# Altium schematic sheet [06]-POWER_SUPPLY.SchDoc
size A4; Organization: Indruino Co., Ltd; Address1: No. 1, Vo Van Ngan Street; Address2: Thu Duc District, HCMC; SheetNumber: 7; SheetTotal: 9
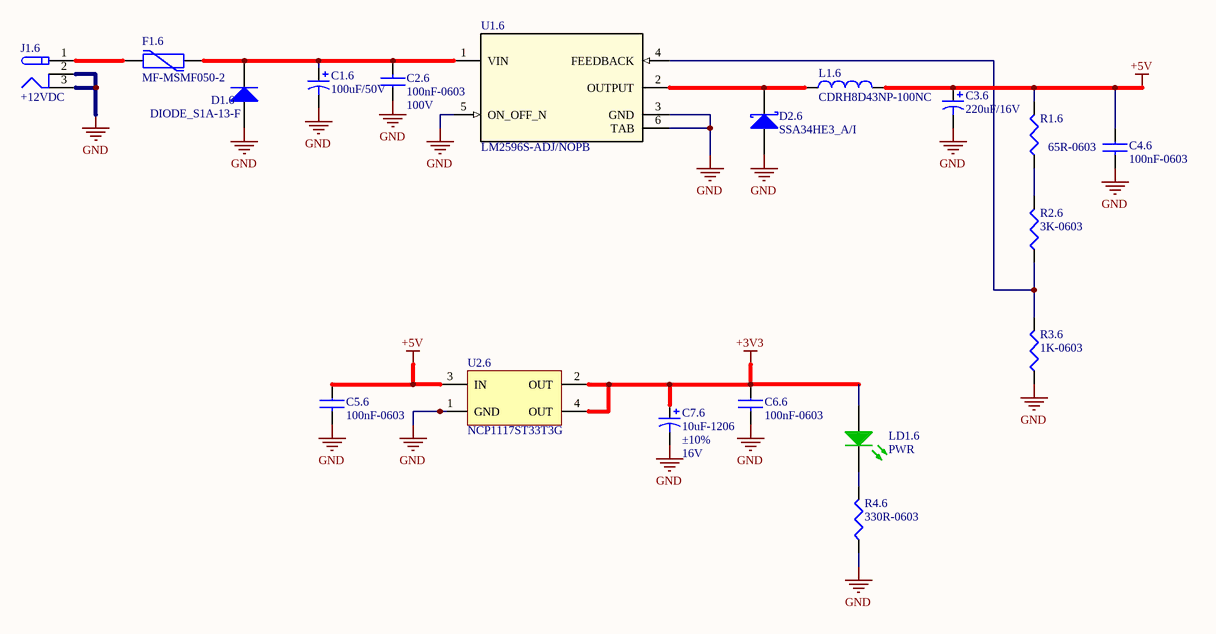
[diagram p0: [06]-POWER_SUPPLY.SchDoc]

## Parts
C1.6  value 100uF/50V  [CAPPR5-10x16]  (hidden comment: Cap Polar)
C2.6  100nF-0603  Voltage - Rated: 100V  [CAP0603]
C3.6  value 220uF/16V  [CAPPR5-10x16]  (hidden comment: Cap Polar)
C4.6  100nF-0603  [CAP0603]
C5.6  100nF-0603  [CAP0603]
C6.6  100nF-0603  [CAP0603]
C7.6  10uF-1206  Tolerance: ±10%  Voltage - Rated: 16V  [CAP1206_TANTALUM_YELLOW]
D1.6  DIODE_S1A-13-F  [DO-214AC]
D2.6  SSA34HE3_A/I  [DO-214AC]
F1.6  MF-MSMF050-2  [FUSE_PTC_SMD1812_02]
J1.6  +12VDC  [DCIN_5.5/2.1]
L1.6  CDRH8D43NP-100NC  [INDC_CDRH8D43]
LD1.6  PWR  [LED_SMD0603_GREEN]
R1.6  65R-0603  [RES0603]
R2.6  3K-0603  [RES0603]
R3.6  1K-0603  [RES0603]
R4.6  330R-0603  [RES0603]
U1.6  LM2596S-ADJ/NOPB  [TO-263-5]
U2.6  NCP1117ST33T3G  [SOT223-4M_AMS1117_3V3]

## Nets
+3V3: C6.6.1 C7.6.1 LD1.6.1(A) U2.6.2(OUT) U2.6.4(OUT)
+5V: C3.6.1 C4.6.1 C5.6.1 L1.6.2 R1.6.2 U2.6.3(IN)
GND: C1.6.2 C2.6.1 C3.6.2 C4.6.2 C5.6.2 C6.6.2 C7.6.2 D1.6.1(A) D2.6.1(A) J1.6.2(NC) J1.6.3(-) R3.6.1 R4.6.1 U1.6.3(GND) U1.6.5(ON_OFF_N) U1.6.6(TAB) U2.6.1(GND)
NetC1.6_1: C1.6.1 C2.6.2 D1.6.2(K) F1.6.2 U1.6.1(VIN)
NetD2.6_2: D2.6.2(K) L1.6.1 U1.6.2(OUTPUT)
NetF1.6_1: F1.6.1 J1.6.1(+)
NetLD1.6_2: LD1.6.2(K) R4.6.2
NetR1.6_1: R1.6.1 R2.6.2
NetR2.6_1: R2.6.1 R3.6.2 U1.6.4(FEEDBACK)

## Notes on the sheet
- Title
- Size:
- Date:
- Author:
- A4
- Time:
- Number:
- Checked:
- Revision:
- Sheet
- Approved:
- of
- File:

## Library data of the parts
C1.6 C3.6 = Cap Polar: Polarized Capacitor; Published: 8-Jun-2000; LatestRevisionDate: 17-Jul-2002; LatestRevisionNote: Re-released for DXP Platform.; PackageReference: POLAR0.8; Publisher: Altium Limited
C2.6 = CC0603KRX7R0BB104: CAP CER 0.1UF 100V X7R 0603; Manufacturer: Yageo; Tolerance: ±10%; Value: 100nF; Supplier 1: Digi-Key; Manufacturer Part Number: CC0603KRX7R0BB104; RoHS: RoHS Compliant; Category: Capacitors; Stock 1: 784508; Pricing 1: 1=0.23, 10=0.156, 100=0.0791, 500=0.05414, 1000=0.0479 (USD); Packaging: Cut Tape (CT); Part Status: Active; Temperature Coefficient: X7R; Operating Temperature: -55°C ~ 125°C; Features: -; Ratings: -; Applications: General Purpose; Failure Rate: -; Mounting Type: Surface Mount, MLCC; Package / Case: 0603 (1608 Metric); Size / Dimension: 0.063" L x 0.032" W (1.60mm x 0.80mm); Height - Seated (Max): -; Thickness (Max): 0.035" (0.90mm); Lead Spacing: -; Lead Style: -; ComponentLink1URL: http://media.digikey.com/pdf/Data%20Sheets/Yageo%20PDFs/NPO,%20X7R%20Mid-voltage.pdf; ComponentLink1Description: http://media.digikey.com/pdf/Data%20Sheets/Yageo%20PDFs/NPO,%20X7R%20Mid-voltage.pdf; Supplier Part Number 1: 311-1523-1-ND
C4.6 C5.6 C6.6 = CC0603KRX7R9BB104: CAP CER 0.1UF 50V X7R 0603; Manufacturer 1: Yageo; Category 1: Capacitors; Capacitance: 0.1µF; Tolerance: ±10%; Value: 100nF; Supplier 1: Digi-Key; Supplier Part Number 1: 311-1344-1-ND; Manufacturer Part Number 1: CC0603KRX7R9BB104; RoHS 1: RoHS Compliant; Description 1: CAP CER 0.1UF 50V X7R 0603; Stock 1: 4411645; Pricing 1: 1=0.1, 10=0.031, 100=0.014, 500=0.00998, 1000=0.00783 (USD); Packaging: Cut Tape (CT); Part Status: Active; Voltage - Rated: 50V; Temperature Coefficient: X7R; Operating Temperature: -55°C ~ 125°C; Features: -; Ratings: -; Applications: General Purpose; Failure Rate: -; Mounting Type: Surface Mount, MLCC; Package / Case: 0603 (1608 Metric); Size / Dimension: 0.063" L x 0.031" W (1.60mm x 0.80mm); Height - Seated (Max): -; Thickness (Max): 0.035" (0.90mm); Lead Spacing: -; Lead Style: -; ComponentLink1URL: http://www.yageo.com/documents/recent/UPY-GPHC_X7R_6.3V-to-50V_18.pdf; ComponentLink1Description: http://www.yageo.com/documents/recent/UPY-GPHC_X7R_6.3V-to-50V_18.pdf
C7.6 = T491A106K016AT: CAP TANT 10UF 16V 10% 1206; Manufacturer 1: KEMET; Manufacturer Size Code: A; Category 1: Capacitors; Capacitance: 10µF; Type: Molded; ESR (Equivalent Series Resistance): 7 Ohm; Lifetime @ Temp.: 2000 Hrs @ 85°C; Supplier 1: Digi-Key; Supplier Part Number 1: 399-8269-1-ND; Manufacturer Part Number 1: T491A106K016AT; RoHS 1: RoHS Compliant; Description 1: CAP TANT 10UF 16V 10% 1206; Stock 1: 54083; Pricing 1: 1=0.45, 10=0.312, 100=0.1873, 500=0.14048, 1000=0.11862 (USD); Packaging: Cut Tape (CT); Part Status: Active; Operating Temperature: -55°C ~ 125°C; Mounting Type: Surface Mount; Package / Case: 1206 (3216 Metric); Size / Dimension: 0.126" L x 0.063" W (3.20mm x 1.60mm); Height - Seated (Max): 0.071" (1.80mm); Lead Spacing: -; Features: General Purpose; Failure Rate: -; ComponentLink1URL: http://www.kemet.com/Lists/ProductCatalog/Attachments/254/KEM_T2005_T491.pdf; ComponentLink1Description: http://www.kemet.com/Lists/ProductCatalog/Attachments/254/KEM_T2005_T491.pdf; Value: 10uF
D1.6 = DIODE_S1A-13-F: DIODE GEN PURP 50V 1A SMA; Manufacturer: Diodes Incorporated; Diode Type: Standard; Speed: Standard Recovery >500ns, > 200mA (Io); Capacitance @ Vr, F: 10pF @ 4V, 1MHz; Supplier 1: Digi-Key; Manufacturer Part Number: S1A-13-F; RoHS: RoHS Compliant; Category: Discrete Semiconductor Products; Stock 1: 293435; Pricing 1: 1=0.27, 10=0.219, 100=0.1163, 500=0.07652, 1000=0.05203 (USD); Packaging: Digi-Reel®; Part Status: Active; Current - Average Rectified (Io): 1A; Mounting Type: Surface Mount; Package / Case: DO-214AC, SMA; Supplier Device Package: SMA; Operating Temperature - Junction: -65°C ~ 150°C; Base Part Number: S1A; ComponentLink1URL: https://www.diodes.com/assets/Datasheets/ds16003.pdf; ComponentLink1Description: https://www.diodes.com/assets/Datasheets/ds16003.pdf; Supplier Part Number 1: S1A-FDIDKR-ND
D2.6 = DIODE_SSA34HE3_A/I: DIODE SCHOTTKY 40V 3A DO214AC; Manufacturer 1: Vishay Semiconductor Diodes Division; Category 1: Discrete Semiconductor Products; Voltage - Forward (Vf) (Max) @ If: 490mV @ 3A; Speed: Fast Recovery =< 500ns, > 200mA (Io); Current - Reverse Leakage @ Vr: 200µA @ 40V; Supplier 1: Digi-Key; Supplier Part Number 1: SSA34HE3_A/I-ND; Manufacturer Part Number 1: SSA34HE3_A/I; RoHS 1: RoHS Compliant; Description 1: DIODE SCHOTTKY 40V 3A DO214AC; Stock 1: 0; Pricing 1: 7500=0.13508 (USD); Packaging: Tape & Reel (TR); Part Status: Active; Diode Type: Schottky; Voltage - DC Reverse (Vr) (Max): 40V; Current - Average Rectified (Io): 3A; Capacitance @ Vr, F: -; Mounting Type: Surface Mount; Package / Case: DO-214AC, SMA; Supplier Device Package: DO-214AC (SMA); Operating Temperature - Junction: -65°C ~ 150°C; ComponentLink1URL: http://www.vishay.com/docs/88883/ssa33l.pdf; ComponentLink1Description: http://www.vishay.com/docs/88883/ssa33l.pdf
F1.6 = FUSE_MF-MSMF050-2: Resettable Fuses - PPTC 0.50A 15V 0.15ohm AE C-Q200; Manufacturer: Bourns; Resistance: 150 mOhms; Type: PTC Resettable Fuses; Current Rating - Max: 100 A; Hold Current: 500 mA; Trip Current: 1 A; Pd - Power Dissipation: 800 mW; Supplier 1: Mouser; Manufacturer Part Number: MF-MSMF050-2; RoHS: RoHS Compliant; Category: Resettable Fuses - PPTC; Stock 1: 36274; Pricing 1: 1=0.310, 10=0.262, 100=0.244, 250=0.217, 500=0.181, 1000=0.172, 2500=0.166, 4000=0.155, 8000=0.129 (USD); Height: 0.85 mm; Length: 4.73 mm; Package / Case: 1812 (4532 metric); Packaging: Cut Tape; Series: MF-MSMF; Termination Style: SMD/SMT; Width: 3.41 mm; Brand: Bourns; Maximum Voltage: 15 V; Mounting Style: SMD/SMT; Maximum Operating Temperature: + 85 C; Minimum Operating Temperature: - 40 C; Product Type: Resettable Fuses - PPTC; Qualification: AEC-Q200; Standard Pack Qty: 4000; Subcategory: PPTC Resettable Fuses; Tradename: Multifuse; RoHS - Mouser: Y; Minimum Order Quantity: 1; Reeling: True; ComponentLink1URL: https://www.mouser.com/datasheet/2/54/mfmsmf-772347.pdf; ComponentLink1Description: https://www.mouser.com/datasheet/2/54/mfmsmf-772347.pdf; Supplier Part Number 1: 652-MF-MSMF050-2
J1.6 = DCIN_5.5/2.1
L1.6 = IND_CDRH8D43NP-100NC: FIXED IND 10UH 3.2A 36 MOHM SMD; Manufacturer: Sumida America Components Inc.; Material - Core: Ferrite; Tolerance: ±30%; Shielding: Shielded; DC Resistance (DCR): 36 mOhm Max; Supplier 1: Digi-Key; Manufacturer Part Number: CDRH8D43NP-100NC; RoHS: RoHS Compliant; Category: Inductors, Coils, Chokes; Stock 1: 2346; Pricing 1: 1=1.21, 10=1.121, 100=0.8108 (USD); Packaging: Cut Tape (CT); Part Status: Active; Type: -; Q @ Freq: -; Ratings: -; Operating Temperature: -40°C ~ 100°C; Mounting Type: Surface Mount; Package / Case: Nonstandard; Supplier Device Package: -; Size / Dimension: 0.315" L x 0.315" W (8.00mm x 8.00mm); Height - Seated (Max): 0.177" (4.50mm); ComponentLink1URL: http://products.sumida.com/products/pdf/CDRH8D43.pdf; ComponentLink1Description: http://products.sumida.com/products/pdf/CDRH8D43.pdf; Supplier Part Number 1: 308-1665-1-ND
LD1.6 = LED_LTST-C191KGKT: LED GREEN CLEAR 0603 SMD; Manufacturer 1: Lite-On Inc.; Category 1: Optoelectronics; Lens Color: Colorless; Millicandela Rating: 35mcd; Lens Style/Size: Rectangle with Flat Top, 1.10mm x 0.80mm; Voltage - Forward (Vf) (Typ): 2V; Current - Test: 20mA; Viewing Angle: 130°; Wavelength - Dominant: 571nm; Wavelength - Peak: 574nm; Supplier 1: Digi-Key; Supplier Part Number 1: 160-1446-1-ND; Manufacturer Part Number 1: LTST-C191KGKT; RoHS 1: RoHS Compliant; Description 1: LED GREEN CLEAR 0603 SMD; Stock 1: 1325167; Pricing 1: 1=0.29, 10=0.211, 25=0.1556, 100=0.1111, 250=0.07556, 500=0.06666, 1000=0.05222, 2500=0.05111 (USD); Packaging: Cut Tape (CT); Part Status: Active; Color: Green; Lens Transparency: Clear; Mounting Type: Surface Mount; Features: -; Size / Dimension: 1.60mm L x 0.80mm W; Height (Max): 0.55mm; ComponentLink1URL: http://optoelectronics.liteon.com/upload/download/DS22-2000-228/S_110_LTST-C191KGKT.pdf; ComponentLink1Description: http://optoelectronics.liteon.com/upload/download/DS22-2000-228/S_110_LTST-C191KGKT.pdf; Package / Case: 0603 (1608 Metric)
R1.6 = RC0603JR-0722RL: RES SMD 22 OHM 5% 1/10W 0603; Manufacturer 1: Yageo; Category 1: Resistors; Resistance (Ohms): 22; Power (Watts): 0.1W, 1/10W; Temperature Coefficient: ±100ppm/°C; Value: 22R; Supplier 1: Digi-Key; Supplier Part Number 1: 311-22GRCT-ND; Manufacturer Part Number 1: RC0603JR-0722RL; RoHS 1: RoHS Compliant; Description 1: RES SMD 22 OHM 5% 1/10W 0603; Stock 1: 344316; Pricing 1: 1=0.1, 10=0.011, 100=0.0044, 1000=0.00198, 2500=0.00172 (USD); Packaging: Cut Tape (CT); Part Status: Active; Composition: Thick Film; Features: Moisture Resistant; Operating Temperature: -55°C ~ 155°C; Package / Case: 0603 (1608 Metric); Size / Dimension: 0.063" L x 0.031" W (1.60mm x 0.80mm); Height - Seated (Max): 0.022" (0.55mm); Failure Rate: -; ComponentLink1URL: http://www.yageo.com/documents/recent/PYu-RC_Group_51_RoHS_L_7.pdf; ComponentLink1Description: http://www.yageo.com/documents/recent/PYu-RC_Group_51_RoHS_L_7.pdf; Tolerance: ±5%; Supplier Device Package: 0603
R2.6 = RC0603JR-073K3L: Thick Film Resistors - SMD 3.3K OHM 5%; Manufacturer: Yageo; Power Rating: 100 mW (1/10 W); Resistance: 3.3 kOhms; Temperature Coefficient: 100 PPM / C; Voltage Rating: 75 V; Value: 3K3; Supplier 1: Mouser; Manufacturer Part Number: RC0603JR-073K3L; RoHS: RoHS Compliant By Exemption; Category: Thick Film Resistors - SMD; Stock 1: 313041; Pricing 1: 1=0.100, 10=0.015, 100=0.005, 1000=0.004, 5000=0.004 (USD); Application: High Reliability; Features: -; Height: 0.45 mm; Length: 1.6 mm; Package / Case: -; Packaging: Cut Tape; Product: Thick Film Resistors SMD; Series: RC; Technology: Thick Film; Termination Style: SMD/SMT; Tolerance: 5 %; Type: General Purpose; Width: 0.8 mm; Brand: Yageo; Mounting Style: PCB Mount; Case Code - in: 0603; Case Code - mm: 1608; Maximum Operating Temperature: + 155 C; Minimum Operating Temperature: - 55 C; Product Type: Thick Film Resistors; Standard Pack Qty: 5000; Subcategory: Resistors; RoHS - Mouser: E; Minimum Order Quantity: 1; Reeling: True; ComponentLink1URL: https://www.mouser.com/datasheet/2/447/PYu-RC_Group_51_RoHS_L_10-1664068.pdf; ComponentLink1Description: https://www.mouser.com/datasheet/2/447/PYu-RC_Group_51_RoHS_L_10-1664068.pdf; Supplier Part Number 1: 603-RC0603JR-073K3L
R3.6 = RC0603JR-071KL: RES SMD 1K OHM 5% 1/10W 0603; Manufacturer 1: Yageo; Category 1: Resistors; Power (Watts): 0.1W, 1/10W; Temperature Coefficient: ±100ppm/°C; Supplier 1: Digi-Key; Supplier Part Number 1: 311-1.0KGRCT-ND; Manufacturer Part Number 1: RC0603JR-071KL; RoHS 1: RoHS Compliant; Description 1: RES SMD 1K OHM 5% 1/10W 0603; Stock 1: 2853955; Pricing 1: 1=0.1, 10=0.011, 100=0.0044, 1000=0.00198, 2500=0.00172 (USD); Packaging: Cut Tape (CT); Part Status: Active; Resistance (Ohms): 1k; Tolerance: ±5%; Composition: Thick Film; Features: Moisture Resistant; Operating Temperature: -55°C ~ 155°C; Package / Case: 0603 (1608 Metric); Supplier Device Package: 0603; Size / Dimension: 0.063" L x 0.031" W (1.60mm x 0.80mm); Height - Seated (Max): 0.022" (0.55mm); Failure Rate: -; ComponentLink1URL: http://www.yageo.com/documents/recent/PYu-RC_Group_51_RoHS_L_7.pdf; ComponentLink1Description: http://www.yageo.com/documents/recent/PYu-RC_Group_51_RoHS_L_7.pdf; Value: 1K
R4.6 = RC0603JR-07330RL: RES SMD 330 OHM 5% 1/10W 0603; Manufacturer 1: Yageo; Category 1: Resistors; Resistance (Ohms): 330; Power (Watts): 0.1W, 1/10W; Temperature Coefficient: ±100ppm/°C; Value: 330R; Supplier 1: Digi-Key; Supplier Part Number 1: 311-330GRCT-ND; Manufacturer Part Number 1: RC0603JR-07330RL; RoHS 1: RoHS Compliant; Description 1: RES SMD 330 OHM 5% 1/10W 0603; Stock 1: 1463213; Pricing 1: 1=0.1, 10=0.011, 100=0.0046, 1000=0.00207, 2500=0.0018 (USD); Packaging: Cut Tape (CT); Part Status: Active; Tolerance: ±5%; Composition: Thick Film; Features: Moisture Resistant; Operating Temperature: -55°C ~ 155°C; Package / Case: 0603 (1608 Metric); Supplier Device Package: 0603; Size / Dimension: 0.063" L x 0.031" W (1.60mm x 0.80mm); Height - Seated (Max): 0.022" (0.55mm); Failure Rate: -; ComponentLink1URL: http://www.yageo.com/documents/recent/PYu-RC_Group_51_RoHS_L_7.pdf; ComponentLink1Description: http://www.yageo.com/documents/recent/PYu-RC_Group_51_RoHS_L_7.pdf
U1.6 = LM2596S-ADJ/NOPB: No Description Available; Mfr_Name: Texas Instruments; PartNumber: LM2596SX-ADJ/NOPB; CompType: IC; Type: DEV; RefDes: RefDes; Copyright: Copyright (C) 2021 Ultra Librarian. All rights reserved.; Manufacturer_Part_Number: LM2596S-ADJ/NOPB; Alternate_PartNumber: LM2596S-ADJ/NOPB; PackageReference: KTT0005B; MountType: SMT; RoHS: Y; Manufacturer: Texas Instruments
U2.6 = NCP1117ST33T3G: LDO Voltage Regulators 3.3V 1A Positive; Manufacturer: ON Semiconductor; Input Voltage MAX: 20 V; Number of Outputs: 1 Output; Output Type: Fixed; Quiescent Current: 10 mA; Dropout Voltage - Max: 1.1 V at 100 mA; Voltage Regulation Accuracy: 1 %; Dropout Voltage: 0.95 V at 100 mA; Ib - Input Bias Current: 6 mA; Line Regulation: 0.8 mV; Load Regulation: 4.3 mV; Supplier 1: Mouser; Manufacturer Part Number: NCP1117ST33T3G; RoHS: RoHS Compliant; Category: LDO Voltage Regulators; Stock 1: 0; Pricing 1: 1=0.450, 10=0.366, 100=0.223, 1000=0.173, 4000=0.147, 8000=0.137, 24000=0.130, 48000=0.127 (USD); Height: 1.69 mm (Max); Length: 6.7 mm (Max); Output Current: 1 A; Output Voltage: 3.3 V; Package / Case: SOT-223-3; Packaging: Cut Tape; Series: NCP1117; Width: 3.7 mm (Max); Brand: ON Semiconductor; Mounting Style: SMD/SMT; Maximum Operating Temperature: + 125 C; Minimum Operating Temperature: 0 C; Polarity: Positive; Standard Pack Qty: 4000; RoHS - Mouser: Y; Minimum Order Quantity: 1; Reeling: True; ComponentLink1URL: https://www.mouser.com/ds/2/308/NCP1117-D-81326.pdf; ComponentLink1Description: https://www.mouser.com/ds/2/308/NCP1117-D-81326.pdf; Supplier Part Number 1: 863-NCP1117ST33T3G